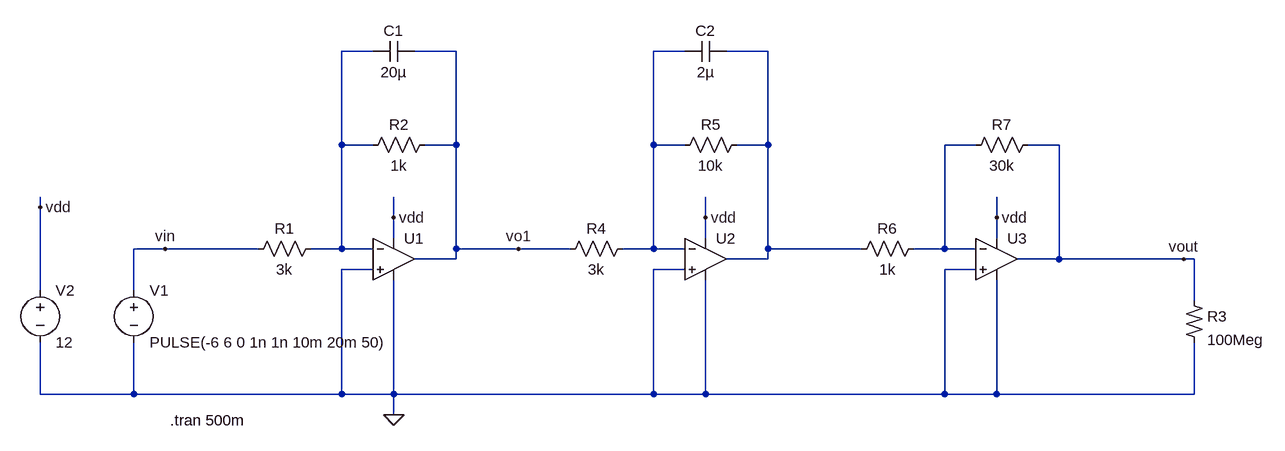
[diagram p0: schematic filter1.asc]
filter1.asc, the LTspice schematic file:
Version 4
SHEET 1 1808 680
WIRE 432 -16 384 -16
WIRE 560 -16 496 -16
WIRE 912 -16 864 -16
WIRE 1040 -16 976 -16
WIRE 384 128 384 -16
WIRE 432 128 384 128
WIRE 560 128 560 -16
WIRE 560 128 512 128
WIRE 864 128 864 -16
WIRE 912 128 864 128
WIRE 1040 128 1040 -16
WIRE 1040 128 992 128
WIRE 1360 128 1312 128
WIRE 1488 128 1440 128
WIRE -80 224 -80 208
WIRE 464 240 464 208
WIRE 944 240 944 208
WIRE 1392 240 1392 208
WIRE 464 272 464 240
WIRE 944 272 944 240
WIRE 1392 272 1392 240
WIRE 112 288 64 288
WIRE 256 288 112 288
WIRE 384 288 384 128
WIRE 384 288 336 288
WIRE 432 288 384 288
WIRE 560 288 560 128
WIRE 656 288 560 288
WIRE 736 288 656 288
WIRE 864 288 864 128
WIRE 864 288 816 288
WIRE 912 288 864 288
WIRE 1040 288 1040 128
WIRE 1184 288 1040 288
WIRE 1312 288 1312 128
WIRE 1312 288 1264 288
WIRE 1360 288 1312 288
WIRE 560 304 560 288
WIRE 560 304 496 304
WIRE 1040 304 1040 288
WIRE 1040 304 976 304
WIRE 1488 304 1488 128
WIRE 1488 304 1424 304
WIRE 1680 304 1488 304
WIRE 1696 304 1680 304
WIRE 432 320 384 320
WIRE 912 320 864 320
WIRE 1360 320 1312 320
WIRE -80 352 -80 224
WIRE 64 352 64 288
WIRE 1696 368 1696 304
WIRE -80 512 -80 432
WIRE 64 512 64 432
WIRE 64 512 -80 512
WIRE 384 512 384 320
WIRE 384 512 64 512
WIRE 464 512 464 336
WIRE 464 512 384 512
WIRE 864 512 864 320
WIRE 864 512 464 512
WIRE 944 512 944 336
WIRE 944 512 864 512
WIRE 1312 512 1312 320
WIRE 1312 512 944 512
WIRE 1392 512 1392 336
WIRE 1392 512 1312 512
WIRE 1696 512 1696 432
WIRE 1696 512 1392 512
WIRE 464 544 464 512
FLAG 464 544 0
FLAG 464 240 vdd
FLAG 1680 304 vout
FLAG 112 288 vin
FLAG 944 240 vdd
FLAG 1392 240 vdd
FLAG 656 288 vo1
FLAG -80 224 vdd
SYMBOL OpAmps/UniversalOpAmp 464 304 R0
SYMATTR InstName U1
SYMBOL res 352 272 R90
WINDOW 0 0 56 VBottom 2
WINDOW 3 32 56 VTop 2
SYMATTR InstName R1
SYMATTR Value 3k
SYMBOL res 528 112 R90
WINDOW 0 0 56 VBottom 2
WINDOW 3 32 56 VTop 2
SYMATTR InstName R2
SYMATTR Value 1k
SYMBOL cap 496 -32 R90
WINDOW 0 0 32 VBottom 2
WINDOW 3 32 32 VTop 2
SYMATTR InstName C1
SYMATTR Value 20µ
SYMBOL voltage 64 336 R0
SYMATTR InstName V1
SYMATTR Value PULSE(-6 6 0 1n 1n 10m 20m 50)
SYMBOL res2 1680 368 R0
SYMATTR InstName R3
SYMATTR Value 100Meg
SYMBOL OpAmps/UniversalOpAmp 944 304 R0
SYMATTR InstName U2
SYMBOL res 832 272 R90
WINDOW 0 0 56 VBottom 2
WINDOW 3 32 56 VTop 2
SYMATTR InstName R4
SYMATTR Value 3k
SYMBOL res 1008 112 R90
WINDOW 0 0 56 VBottom 2
WINDOW 3 32 56 VTop 2
SYMATTR InstName R5
SYMATTR Value 10k
SYMBOL cap 976 -32 R90
WINDOW 0 0 32 VBottom 2
WINDOW 3 32 32 VTop 2
SYMATTR InstName C2
SYMATTR Value 2µ
SYMBOL OpAmps/UniversalOpAmp 1392 304 R0
SYMATTR InstName U3
SYMBOL res 1280 272 R90
WINDOW 0 0 56 VBottom 2
WINDOW 3 32 56 VTop 2
SYMATTR InstName R6
SYMATTR Value 1k
SYMBOL res 1456 112 R90
WINDOW 0 0 56 VBottom 2
WINDOW 3 32 56 VTop 2
SYMATTR InstName R7
SYMATTR Value 30k
SYMBOL voltage -80 336 R0
SYMATTR InstName V2
SYMATTR Value 12
TEXT 120 552 Left 2 !.tran 500m

The netlist it stands for:
* filter1.asc
XU1 0 N001 vdd 0 vo1 level1 Avol=1Meg GBW=10Meg Vos=0 En=0 Enk=0 In=0 Ink=0 Rin=500Meg  ; pins In+ In- V+ V- OUT
R1 N001 vin 3k
R2 vo1 N001 1k
C1 vo1 N001 20µ
V1 vin 0 PULSE(-6 6 0 1n 1n 10m 20m 50)
R3 vout 0 100Meg
XU2 0 N002 vdd 0 N003 level1 Avol=1Meg GBW=10Meg Vos=0 En=0 Enk=0 In=0 Ink=0 Rin=500Meg  ; pins In+ In- V+ V- OUT
R4 N002 vo1 3k
R5 N003 N002 10k
C2 N003 N002 2µ
XU3 0 N004 vdd 0 vout level1 Avol=1Meg GBW=10Meg Vos=0 En=0 Enk=0 In=0 Ink=0 Rin=500Meg  ; pins In+ In- V+ V- OUT
R6 N004 N003 1k
R7 vout N004 30k
V2 vdd 0 12
.tran 500m
.lib UniversalOpAmp1.lib
.backanno
.end